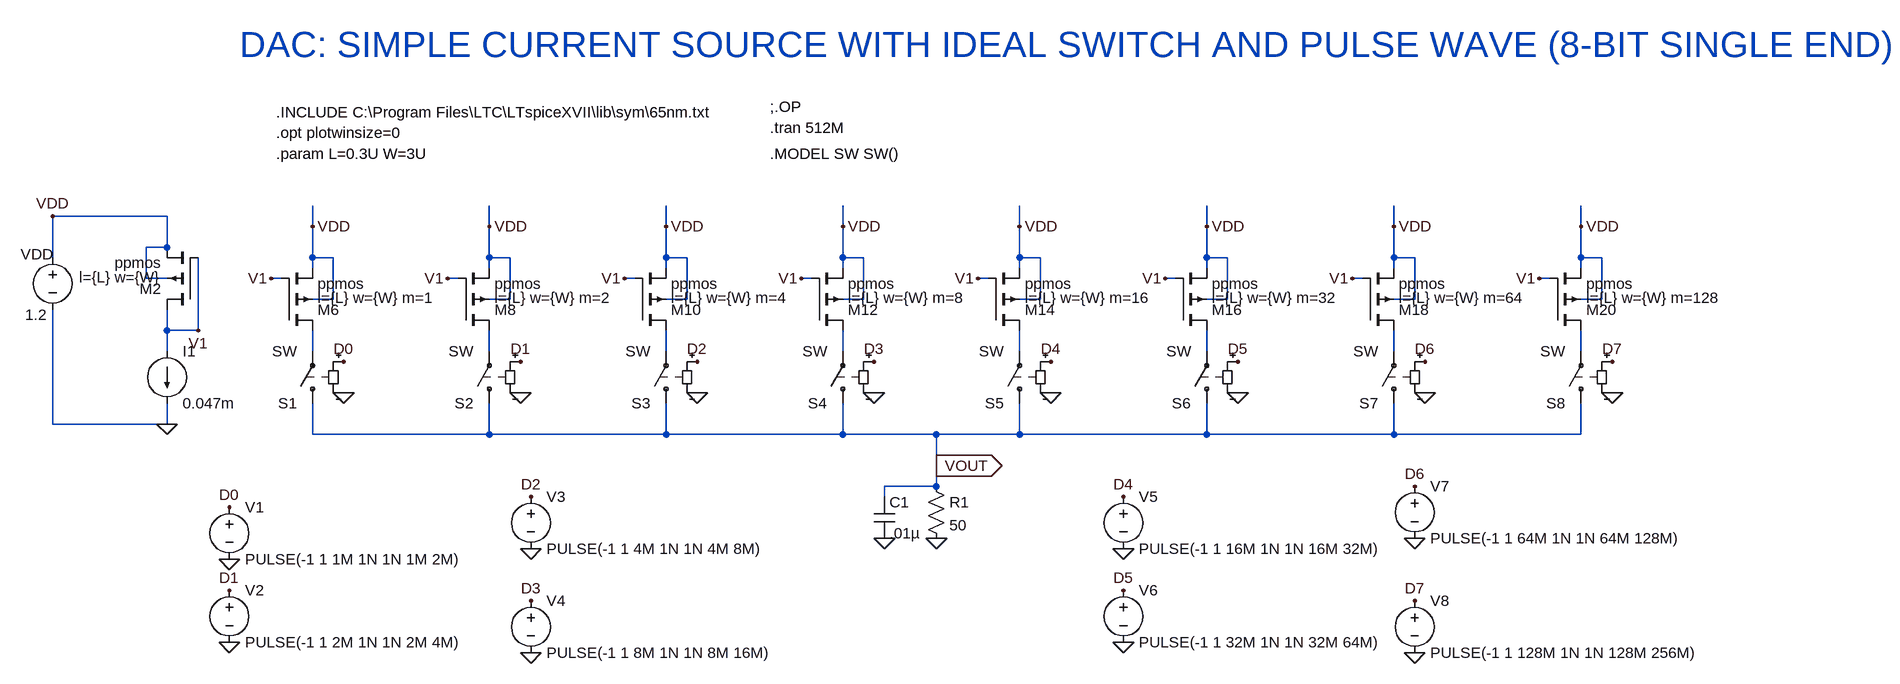
[diagram p0: schematic 101DAC_SIMPLE_PULSE.asc]
101DAC_SIMPLE_PULSE.asc, the LTspice schematic file:
Version 4
SHEET 1 1812 704
WIRE -784 -224 -960 -224
WIRE -560 -208 -560 -240
WIRE -288 -208 -288 -240
WIRE -16 -208 -16 -240
WIRE 256 -208 256 -240
WIRE 528 -208 528 -240
WIRE 816 -208 816 -240
WIRE 1104 -208 1104 -240
WIRE 1392 -208 1392 -240
WIRE -784 -176 -784 -224
WIRE -784 -176 -816 -176
WIRE -960 -160 -960 -224
WIRE -560 -160 -560 -208
WIRE -528 -160 -560 -160
WIRE -288 -160 -288 -208
WIRE -256 -160 -288 -160
WIRE -16 -160 -16 -208
WIRE 16 -160 -16 -160
WIRE 256 -160 256 -208
WIRE 288 -160 256 -160
WIRE 528 -160 528 -208
WIRE 560 -160 528 -160
WIRE 816 -160 816 -208
WIRE 848 -160 816 -160
WIRE 1104 -160 1104 -208
WIRE 1136 -160 1104 -160
WIRE 1392 -160 1392 -208
WIRE 1424 -160 1392 -160
WIRE -560 -144 -560 -160
WIRE -288 -144 -288 -160
WIRE -16 -144 -16 -160
WIRE 256 -144 256 -160
WIRE 528 -144 528 -160
WIRE 816 -144 816 -160
WIRE 1104 -144 1104 -160
WIRE 1392 -144 1392 -160
WIRE -816 -128 -816 -176
WIRE -784 -128 -816 -128
WIRE -608 -128 -624 -128
WIRE -336 -128 -352 -128
WIRE -64 -128 -80 -128
WIRE 208 -128 192 -128
WIRE 480 -128 464 -128
WIRE 768 -128 752 -128
WIRE 1056 -128 1040 -128
WIRE 1344 -128 1328 -128
WIRE -528 -96 -528 -160
WIRE -528 -96 -560 -96
WIRE -256 -96 -256 -160
WIRE -256 -96 -288 -96
WIRE 16 -96 16 -160
WIRE 16 -96 -16 -96
WIRE 288 -96 288 -160
WIRE 288 -96 256 -96
WIRE 560 -96 560 -160
WIRE 560 -96 528 -96
WIRE 848 -96 848 -160
WIRE 848 -96 816 -96
WIRE 1136 -96 1136 -160
WIRE 1136 -96 1104 -96
WIRE 1424 -96 1424 -160
WIRE 1424 -96 1392 -96
WIRE -784 -48 -784 -80
WIRE -736 -48 -736 -160
WIRE -736 -48 -784 -48
WIRE -784 -16 -784 -48
WIRE -560 -16 -560 -48
WIRE -288 -16 -288 -48
WIRE -16 -16 -16 -48
WIRE 256 -16 256 -48
WIRE 528 -16 528 -48
WIRE 816 -16 816 -48
WIRE 1104 -16 1104 -48
WIRE 1392 -16 1392 -48
WIRE -960 96 -960 -80
WIRE -784 96 -784 64
WIRE -784 96 -960 96
WIRE -560 112 -560 64
WIRE -288 112 -288 64
WIRE -288 112 -560 112
WIRE -16 112 -16 64
WIRE -16 112 -288 112
WIRE 256 112 256 64
WIRE 256 112 -16 112
WIRE 400 112 256 112
WIRE 528 112 528 64
WIRE 528 112 400 112
WIRE 816 112 816 64
WIRE 816 112 528 112
WIRE 1104 112 1104 64
WIRE 1104 112 816 112
WIRE 1392 112 1392 64
WIRE 1392 112 1104 112
WIRE 400 160 400 112
WIRE 400 192 400 160
WIRE 400 192 320 192
WIRE 320 208 320 192
FLAG -736 -48 V1
FLAG -624 -128 V1
FLAG -560 -208 VDD
FLAG -960 -224 VDD
FLAG -352 -128 V1
FLAG -288 -208 VDD
FLAG -80 -128 V1
FLAG -16 -208 VDD
FLAG 192 -128 V1
FLAG 256 -208 VDD
FLAG 464 -128 V1
FLAG 528 -208 VDD
FLAG 752 -128 V1
FLAG 816 -208 VDD
FLAG 1040 -128 V1
FLAG 1104 -208 VDD
FLAG 1328 -128 V1
FLAG 1392 -208 VDD
FLAG -512 48 0
FLAG -240 48 0
FLAG 32 48 0
FLAG 304 48 0
FLAG 576 48 0
FLAG 864 48 0
FLAG 1152 48 0
FLAG 1440 48 0
FLAG 400 272 0
FLAG -512 0 D0
FLAG -240 0 D1
FLAG 32 0 D2
FLAG 304 0 D3
FLAG 576 0 D4
FLAG 864 0 D5
FLAG 1152 0 D6
FLAG 1440 0 D7
FLAG -784 96 0
FLAG 400 160 VOUT
IOPIN 400 160 Out
FLAG -688 304 0
FLAG -688 432 0
FLAG -224 288 0
FLAG -224 448 0
FLAG 688 288 0
FLAG 688 432 0
FLAG 1136 272 0
FLAG 1136 448 0
FLAG -688 224 D0
FLAG -688 352 D1
FLAG -224 208 D2
FLAG -224 368 D3
FLAG 688 208 D4
FLAG 688 352 D5
FLAG 1136 192 D6
FLAG 1136 368 D7
FLAG 320 272 0
SYMBOL pmos4 -736 -80 R180
WINDOW 123 56 50 Left 2
SYMATTR Value2 l={L} w={W}
SYMATTR InstName M2
SYMATTR Value ppmos
SYMBOL current -784 -16 R0
WINDOW 123 0 0 Left 0
WINDOW 39 0 0 Left 0
SYMATTR InstName I1
SYMATTR Value 0.047m
SYMBOL pmos4 -608 -48 M180
WINDOW 123 56 50 Left 2
SYMATTR Value2 l={L} w={W} m=1
SYMATTR InstName M6
SYMATTR Value ppmos
SYMBOL voltage -960 -176 R0
WINDOW 123 0 0 Left 0
WINDOW 39 0 0 Left 0
WINDOW 0 -49 11 Left 2
WINDOW 3 -42 104 Left 2
SYMATTR InstName VDD
SYMATTR Value 1.2
SYMBOL pmos4 -336 -48 M180
WINDOW 123 56 50 Left 2
SYMATTR Value2 l={L} w={W} m=2
SYMATTR InstName M8
SYMATTR Value ppmos
SYMBOL pmos4 -64 -48 M180
WINDOW 123 56 50 Left 2
SYMATTR Value2 l={L} w={W} m=4
SYMATTR InstName M10
SYMATTR Value ppmos
SYMBOL pmos4 208 -48 M180
WINDOW 123 56 50 Left 2
SYMATTR Value2 l={L} w={W} m=8
SYMATTR InstName M12
SYMATTR Value ppmos
SYMBOL pmos4 480 -48 M180
WINDOW 123 56 50 Left 2
SYMATTR Value2 l={L} w={W} m=16
SYMATTR InstName M14
SYMATTR Value ppmos
SYMBOL pmos4 768 -48 M180
WINDOW 123 56 50 Left 2
SYMATTR Value2 l={L} w={W} m=32
SYMATTR InstName M16
SYMATTR Value ppmos
SYMBOL pmos4 1056 -48 M180
WINDOW 123 56 50 Left 2
SYMATTR Value2 l={L} w={W} m=64
SYMATTR InstName M18
SYMATTR Value ppmos
SYMBOL pmos4 1344 -48 M180
WINDOW 123 56 50 Left 2
SYMATTR Value2 l={L} w={W} m=128
SYMATTR InstName M20
SYMATTR Value ppmos
SYMBOL res 384 176 R0
SYMATTR InstName R1
SYMATTR Value 50
SYMBOL sw -560 80 R180
SYMATTR InstName S1
SYMBOL sw -288 80 R180
SYMATTR InstName S2
SYMBOL sw -16 80 R180
SYMATTR InstName S3
SYMBOL sw 256 80 R180
SYMATTR InstName S4
SYMBOL sw 528 80 R180
SYMATTR InstName S5
SYMBOL sw 816 80 R180
SYMATTR InstName S6
SYMBOL sw 1104 80 R180
SYMATTR InstName S7
SYMBOL sw 1392 80 R180
SYMATTR InstName S8
SYMBOL voltage -688 208 R0
WINDOW 123 0 0 Left 0
WINDOW 39 0 0 Left 0
SYMATTR InstName V1
SYMATTR Value PULSE(-1 1 1M 1N 1N 1M 2M)
SYMBOL voltage -688 336 R0
SYMATTR InstName V2
SYMATTR Value PULSE(-1 1 2M 1N 1N 2M 4M)
SYMBOL voltage -224 192 R0
SYMATTR InstName V3
SYMATTR Value PULSE(-1 1 4M 1N 1N 4M 8M)
SYMBOL voltage -224 352 R0
SYMATTR InstName V4
SYMATTR Value PULSE(-1 1 8M 1N 1N 8M 16M)
SYMBOL voltage 688 192 R0
SYMATTR InstName V5
SYMATTR Value PULSE(-1 1 16M 1N 1N 16M 32M)
SYMBOL voltage 688 336 R0
SYMATTR InstName V6
SYMATTR Value PULSE(-1 1 32M 1N 1N 32M 64M)
SYMBOL voltage 1136 176 R0
SYMATTR InstName V7
SYMATTR Value PULSE(-1 1 64M 1N 1N 64M 128M)
SYMBOL voltage 1136 352 R0
SYMATTR InstName V8
SYMATTR Value PULSE(-1 1 128M 1N 1N 128M 256M)
SYMBOL cap 304 208 R0
SYMATTR InstName C1
SYMATTR Value .01µ
TEXT -616 -384 Left 2 !.INCLUDE C:\\Program Files\\LTC\\LTspiceXVII\\lib\\sym\\65nm.txt
TEXT -616 -352 Left 2 !.opt plotwinsize=0
TEXT 144 -392 Left 2 !;.OP
TEXT -616 -320 Left 2 !.param L=0.3U W=3U
TEXT 144 -360 Left 2 !.tran 512M
TEXT 144 -320 Left 2 !.MODEL SW SW()
TEXT -672 -488 Left 5 ;DAC: SIMPLE CURRENT SOURCE WITH IDEAL SWITCH AND PULSE WAVE (8-BIT SINGLE END)

The netlist it stands for:
* 101DAC_SIMPLE_PULSE.asc
M2 V1 V1 VDD VDD ppmos l={L} w={W}
I1 V1 0 0.047m
M6 N001 V1 VDD VDD ppmos l={L} w={W} m=1
VDD VDD 0 1.2
M8 N002 V1 VDD VDD ppmos l={L} w={W} m=2
M10 N003 V1 VDD VDD ppmos l={L} w={W} m=4
M12 N004 V1 VDD VDD ppmos l={L} w={W} m=8
M14 N005 V1 VDD VDD ppmos l={L} w={W} m=16
M16 N006 V1 VDD VDD ppmos l={L} w={W} m=32
M18 N007 V1 VDD VDD ppmos l={L} w={W} m=64
M20 N008 V1 VDD VDD ppmos l={L} w={W} m=128
R1 VOUT 0 50
S1 VOUT N001 D0 0 SW
S2 VOUT N002 D1 0 SW
S3 VOUT N003 D2 0 SW
S4 VOUT N004 D3 0 SW
S5 VOUT N005 D4 0 SW
S6 VOUT N006 D5 0 SW
S7 VOUT N007 D6 0 SW
S8 VOUT N008 D7 0 SW
V1 D0 0 PULSE(-1 1 1M 1N 1N 1M 2M)
V2 D1 0 PULSE(-1 1 2M 1N 1N 2M 4M)
V3 D2 0 PULSE(-1 1 4M 1N 1N 4M 8M)
V4 D3 0 PULSE(-1 1 8M 1N 1N 8M 16M)
V5 D4 0 PULSE(-1 1 16M 1N 1N 16M 32M)
V6 D5 0 PULSE(-1 1 32M 1N 1N 32M 64M)
V7 D6 0 PULSE(-1 1 64M 1N 1N 64M 128M)
V8 D7 0 PULSE(-1 1 128M 1N 1N 128M 256M)
C1 VOUT 0 .01µ
.model NMOS NMOS
.model PMOS PMOS
.lib standard.mos
.INCLUDE C:\Program Files\LTC\LTspiceXVII\lib\sym\65nm.txt
.opt plotwinsize=0
;.OP
.param L=0.3U W=3U
.tran 512M
.MODEL SW SW()
* DAC: SIMPLE CURRENT SOURCE WITH IDEAL SWITCH AND PULSE WAVE (8-BIT SINGLE END)
.backanno
.end